# EAGLE design ESP (EAGLE 7.6.0)
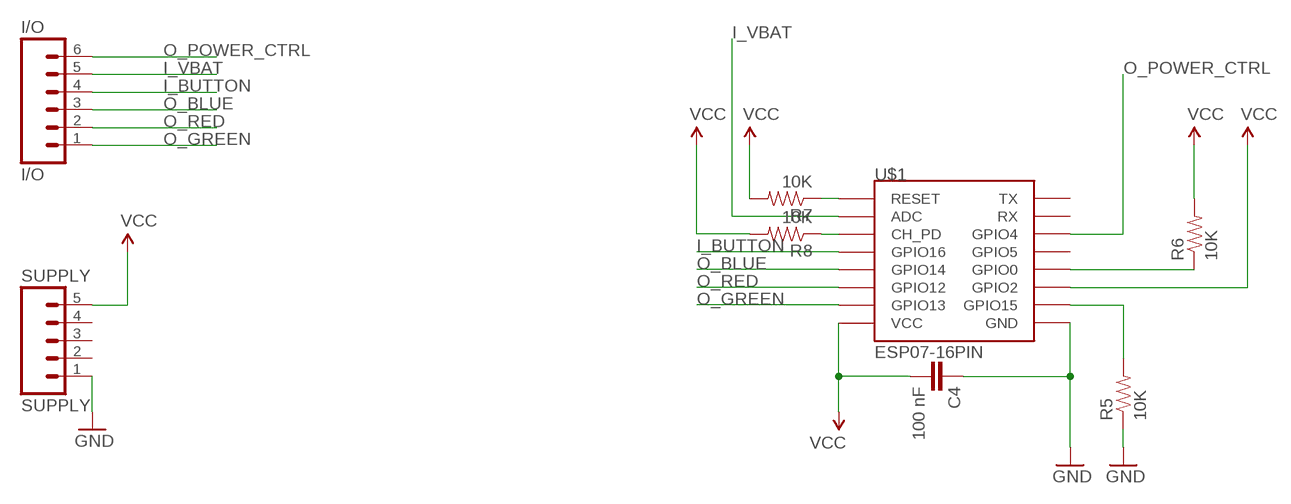
[diagram p0: schematic, sheet 1]

## Parts
C4  100 nF  CAP0805  [0805]
I/O  I/O  M06NO_SILK_FEMALE_PTH  [1X06_NO_SILK]
R5  10K  RESISTOR0805-RES  [0805]
R6  10K  RESISTOR0805-RES  [0805]
R7  10K  RESISTOR0805-RES  [0805]
R8  10K  RESISTOR0805-RES  [0805]
SUPPLY  SUPPLY  M05NO_SILK  [1X05_NO_SILK]
U$1  ESP07-16PIN  [ESP07-16PIN]

## Nets
GND: C4.1 R5.1 SUPPLY.1 U$1.GND
I_BUTTON: I/O.4 U$1.GPIO16
I_VBAT: I/O.5 U$1.ADC
N$1: R5.2 U$1.GPIO15
N$6: R6.1 U$1.GPIO0
N$9: R7.1 U$1.REST(RESET)
N$10: R8.1 U$1.CH_PD
O_BLUE: I/O.3 U$1.GPIO14
O_GREEN: I/O.1 U$1.GPIO13
O_POWER_CTRL: I/O.6 U$1.GPIO4
O_RED: I/O.2 U$1.GPIO12
VCC [SUPPLY]: C4.2 R6.2 R7.2 R8.2 SUPPLY.5 U$1.GPIO2 U$1.VCC
Unconnected: SUPPLY.2 SUPPLY.3 SUPPLY.4 U$1.GPIO5 U$1.RX U$1.TX

## Library data of the parts
C4 = SparkFun-Capacitors:CAP: Capacitor Standard 0603 ceramic capacitor, and 0.1" leaded capacitor.
I/O = SparkFun-Connectors:M06: Header 6 Standard 6-pin 0.1" header. Use with straight break away headers (SKU : PRT-00116), right angle break away headers (PRT-00553), swiss pins (PRT-00743), machine pins (PRT-00117), and female headers (PRT-00115). Molex polarized connector foot print use with SKU : PRT-08094 with associated crimp pins and housings. NOTES ON THE VARIANTS LOCK and LOCK_LONGPADS... This footprint was designed to help hold the alignment of a through-hole component (i.e. 6-pin header) while soldering it into place. You may notice that each hole has been shifted either up or down by 0.005 of an inch from it's more standard position (which is a perfectly straight line). This slight alteration caused the pins (the squares in the middle) to touch the edges of the holes. Because they are alternating, it causes a "brace" to hold the component in place. 0.005 has proven to be the perfect amount of "off-center" position when using our standard breakaway headers. Although looks a little odd when you look at the bare footprint, once you have a header in there, the alteration is very hard to notice. Also,if you push a header all the way into place, it is covered up entirely on the bottom side. This idea of altering the position of holes to aid alignment will be further integrated into the Sparkfun Library for other footprints. It can help hold any component with 3 or more connection pins.; PROD_ID: CONN-08437
R5-R8 = SparkFun-Resistors:RESISTOR: Resistor Basic schematic elements and footprints for 0603, 1206, and PTH resistors.
SUPPLY = SparkFun-Connectors:M05: Header 5 Standard 5-pin 0.1" header. Use with straight break away headers (SKU : PRT-00116), right angle break away headers (PRT-00553), swiss pins (PRT-00743), machine pins (PRT-00117), and female headers (PRT-00115). Molex polarized connector foot print use with SKU : PRT-08230 with associated crimp pins and housings.
U$1 = esp8266modules:ESP07-16PIN: ESP8266 Wifi module 07 - 16 pins; DIMENSIONS: 22.0 x 16.0 mm; PINS: 16; PITCH: 0.078" / 2 mm

## Net classes
0 default: width 0.3 mm
1 GND: width 0.5 mm, clearance 0.5 mm
2 SUPPLY: width 0.5 mm, clearance 0.003 mm

## Board
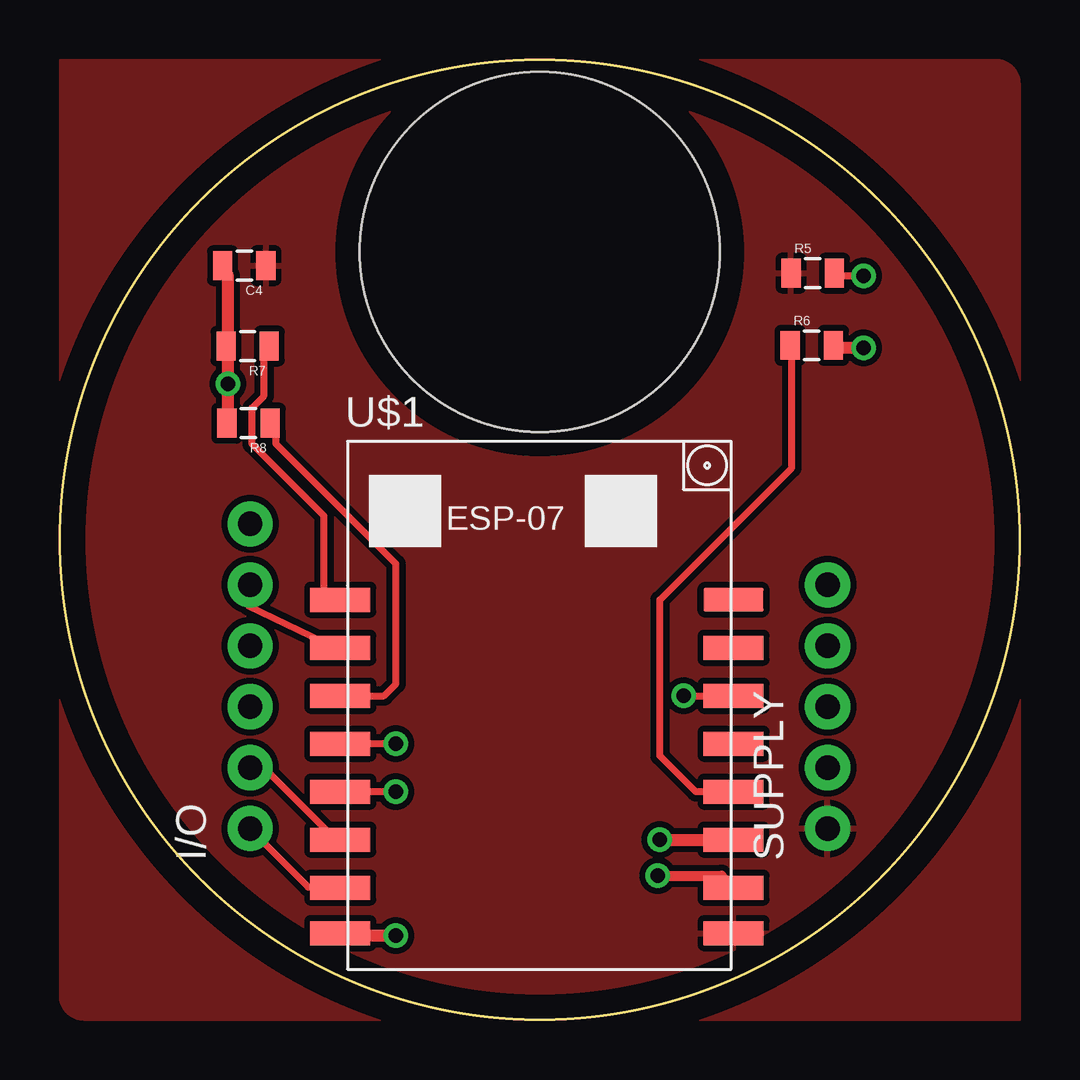
[diagram p1: board, top side]
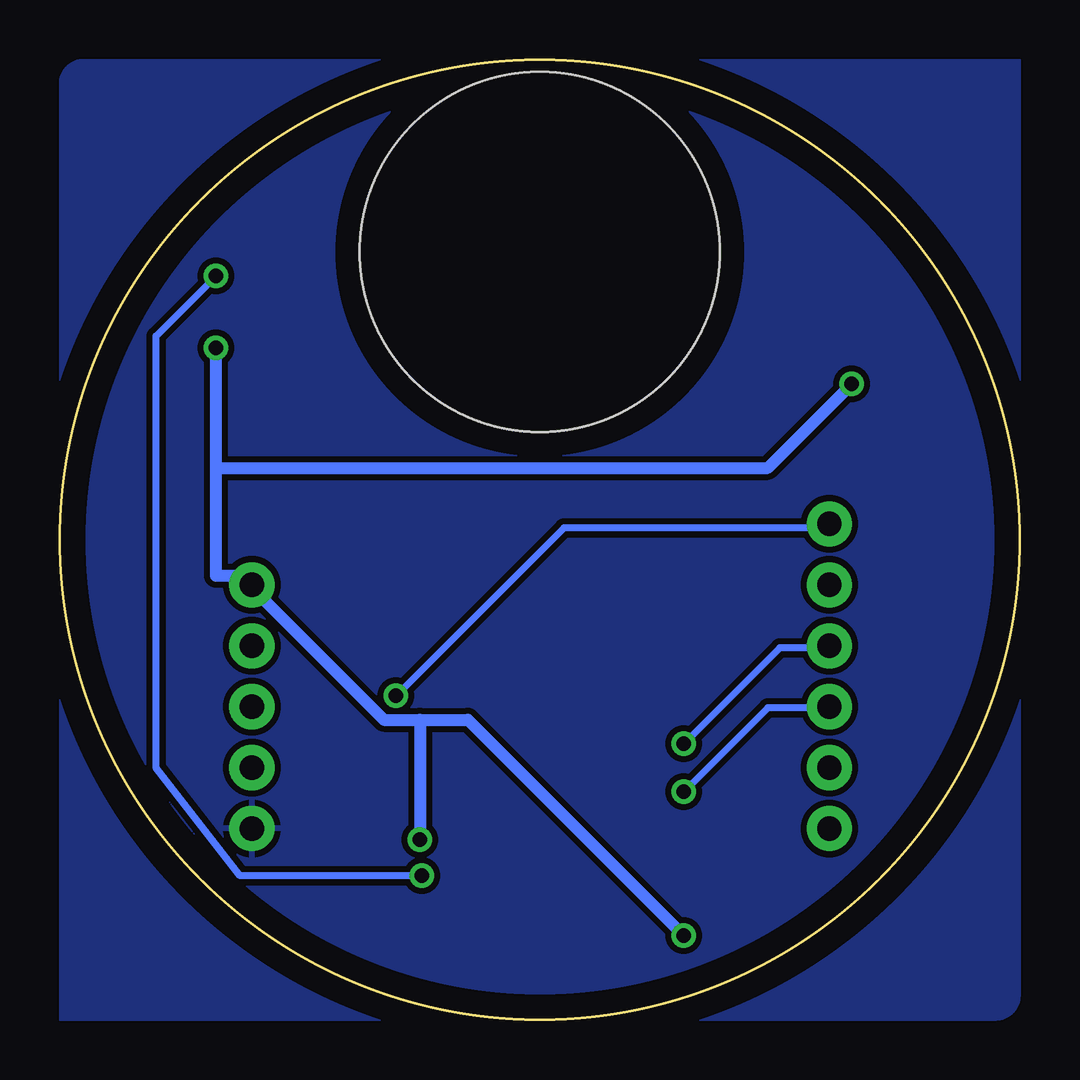
[diagram p2: board, bottom side, seen from below]

Size 40 x 40 mm. Coordinates in mm from the lower left corner, seen from the top.
Outline: circle at 20,20 radius 20
Copper layers (1*16): Top 0.035mm / dielectric 1.5mm / Bottom 0.035mm
Design rules "baballe": minimum track width 5mil, minimum drill 24mil, track to track 4mil, track to pad 4mil, pad to pad 4mil, via to via 4mil, smd to smd 2mil, copper to edge 40mil, drill to drill 8mil, minimum pad ring 10mil, minimum via ring 8mil, stop-mask expansion 4mil, vias tented up to drill 0mil, thermal gap 10mil
Holes 15 mm at 20,32

### Footprints (pad centres in the part's own frame; a part is rotated, then mirrored left to right if it is on the bottom)
0805 = smd 0.8 x 1.2: 1 -0.9,0; 2 0.9,0
1X06_NO_SILK = drill 1.016 pad 1.88: 1 0,0; 2 2.54,0; 3 5.08,0; 4 7.62,0; 5 10.16,0; 6 12.7,0
1X05_NO_SILK = drill 1.016 pad 1.88: 1 0,0; 2 2.54,0; 3 5.08,0; 4 7.62,0; 5 10.16,0
ESP07-16PIN = smd 2.5 x 1: ADC -8.2,3.8; CH_PD -8.2,1.8; GND 8.2,-8.105; GPIO0 8.2,-2.2; GPIO2 8.2,-4.2; GPIO4 8.2,1.8; GPIO5 8.2,-0.2; GPIO12 -8.2,-4.2; GPIO13 -8.2,-6.2; GPIO14 -8.2,-2.2; GPIO15 8.2,-6.2; GPIO16 -8.2,-0.2; REST -8.2,5.8; RX 8.2,3.8; TX 8.2,5.8; VCC -8.2,-8.105

### Placement (x,y rotation side)
C4  7.68,31.43 180 top
I/O  7.93,7.96 90 top
R5  31.38,31.11 0 top
R6  31.34,28.1 0 top
R7  7.82,28.07 180 top
R8  7.86,24.86 180 top
SUPPLY  32,7.96 90 top
U$1  19.88,11.7 0 top

### Tracks (layer width: path | path; a pad name or v marks a point on that pad's centre or on a via)
GND
  pour Top (isolate 0.254): 0,40 39,40 arc-90 40,39 40,0 1,0 arc-90 0,1
  pour Bottom (isolate 0.254): 0,40 39,40 arc-90 40,39 40,0 1,0 arc-90 0,1
I_BUTTON  (via drill 0.61)
  Top 0.3: v14,11.5 U$1.GPIO16
  Bottom 0.3: v14,11.5 10,15.5 8.5,15.5 I/O.4
I_VBAT
  Top 0.3: U$1.ADC 11.5,15.5 7.87,17.23 I/O.5
N$1  (via drill 0.61)
  Top 0.3: v33.5,31 32.5,31 R5.2
  Top 0.406: v24.92,6 27.58,6 U$1.GPIO15
  Bottom 0.3: v33.5,31 36,28.5 36,10.5 32.5,6 v24.92,6
N$6
  Top 0.3: U$1.GPIO0 26.5,9.5 25,11 25,17.5 30.5,23 30.5,28 R6.1
N$9
  Top 0.3: U$1.REST 11,17.5 11,21 8,24 8,25.5 8.5,26 8.5,28 R7.1
N$10
  Top 0.3: U$1.CH_PD 13.5,13.5 14,14 14,19 9,24 9,24.5 R8.1
O_BLUE  (via drill 0.61)
  Top 0.3: v14,9.5 U$1.GPIO14
  Bottom 0.3: v14,9.5 10.5,13 8.5,13 I/O.3
O_GREEN
  Top 0.3: U$1.GPIO13 11.65,5.53 10.34,5.53 7.93,7.94 I/O.1
O_POWER_CTRL  (via drill 0.61)
  Top 0.3: v26,13.5 U$1.GPIO4
  Bottom 0.3: v26,13.5 19,20.5 8.5,20.5 I/O.6
O_RED
  Top 0.3: U$1.GPIO12 11.5,7.5 8.5,10.5 I/O.2
VCC  (via drill 0.61)
  Top 0.5: R8.2 7,25 v7,26.5 7,28 R7.2 7,28.5 7,31 C4.2 | v33.5,28 32.5,28 R6.2 | v14,3.5 12,3.5 U$1.VCC | v25,7.5 U$1.GPIO2
  Bottom 0.5: 33.5,23 33.5,18.5 32,18.5 SUPPLY.5 32,18 26.5,12.5 25,12.5 | 33.5,23 v33.5,28 | v14,3.5 23,12.5 25,12.5 | 25,12.5 v25,7.5 | v7,26.5 10.5,23 33.5,23